# EAGLE schematic t10_schem (EAGLE 7.1.0)
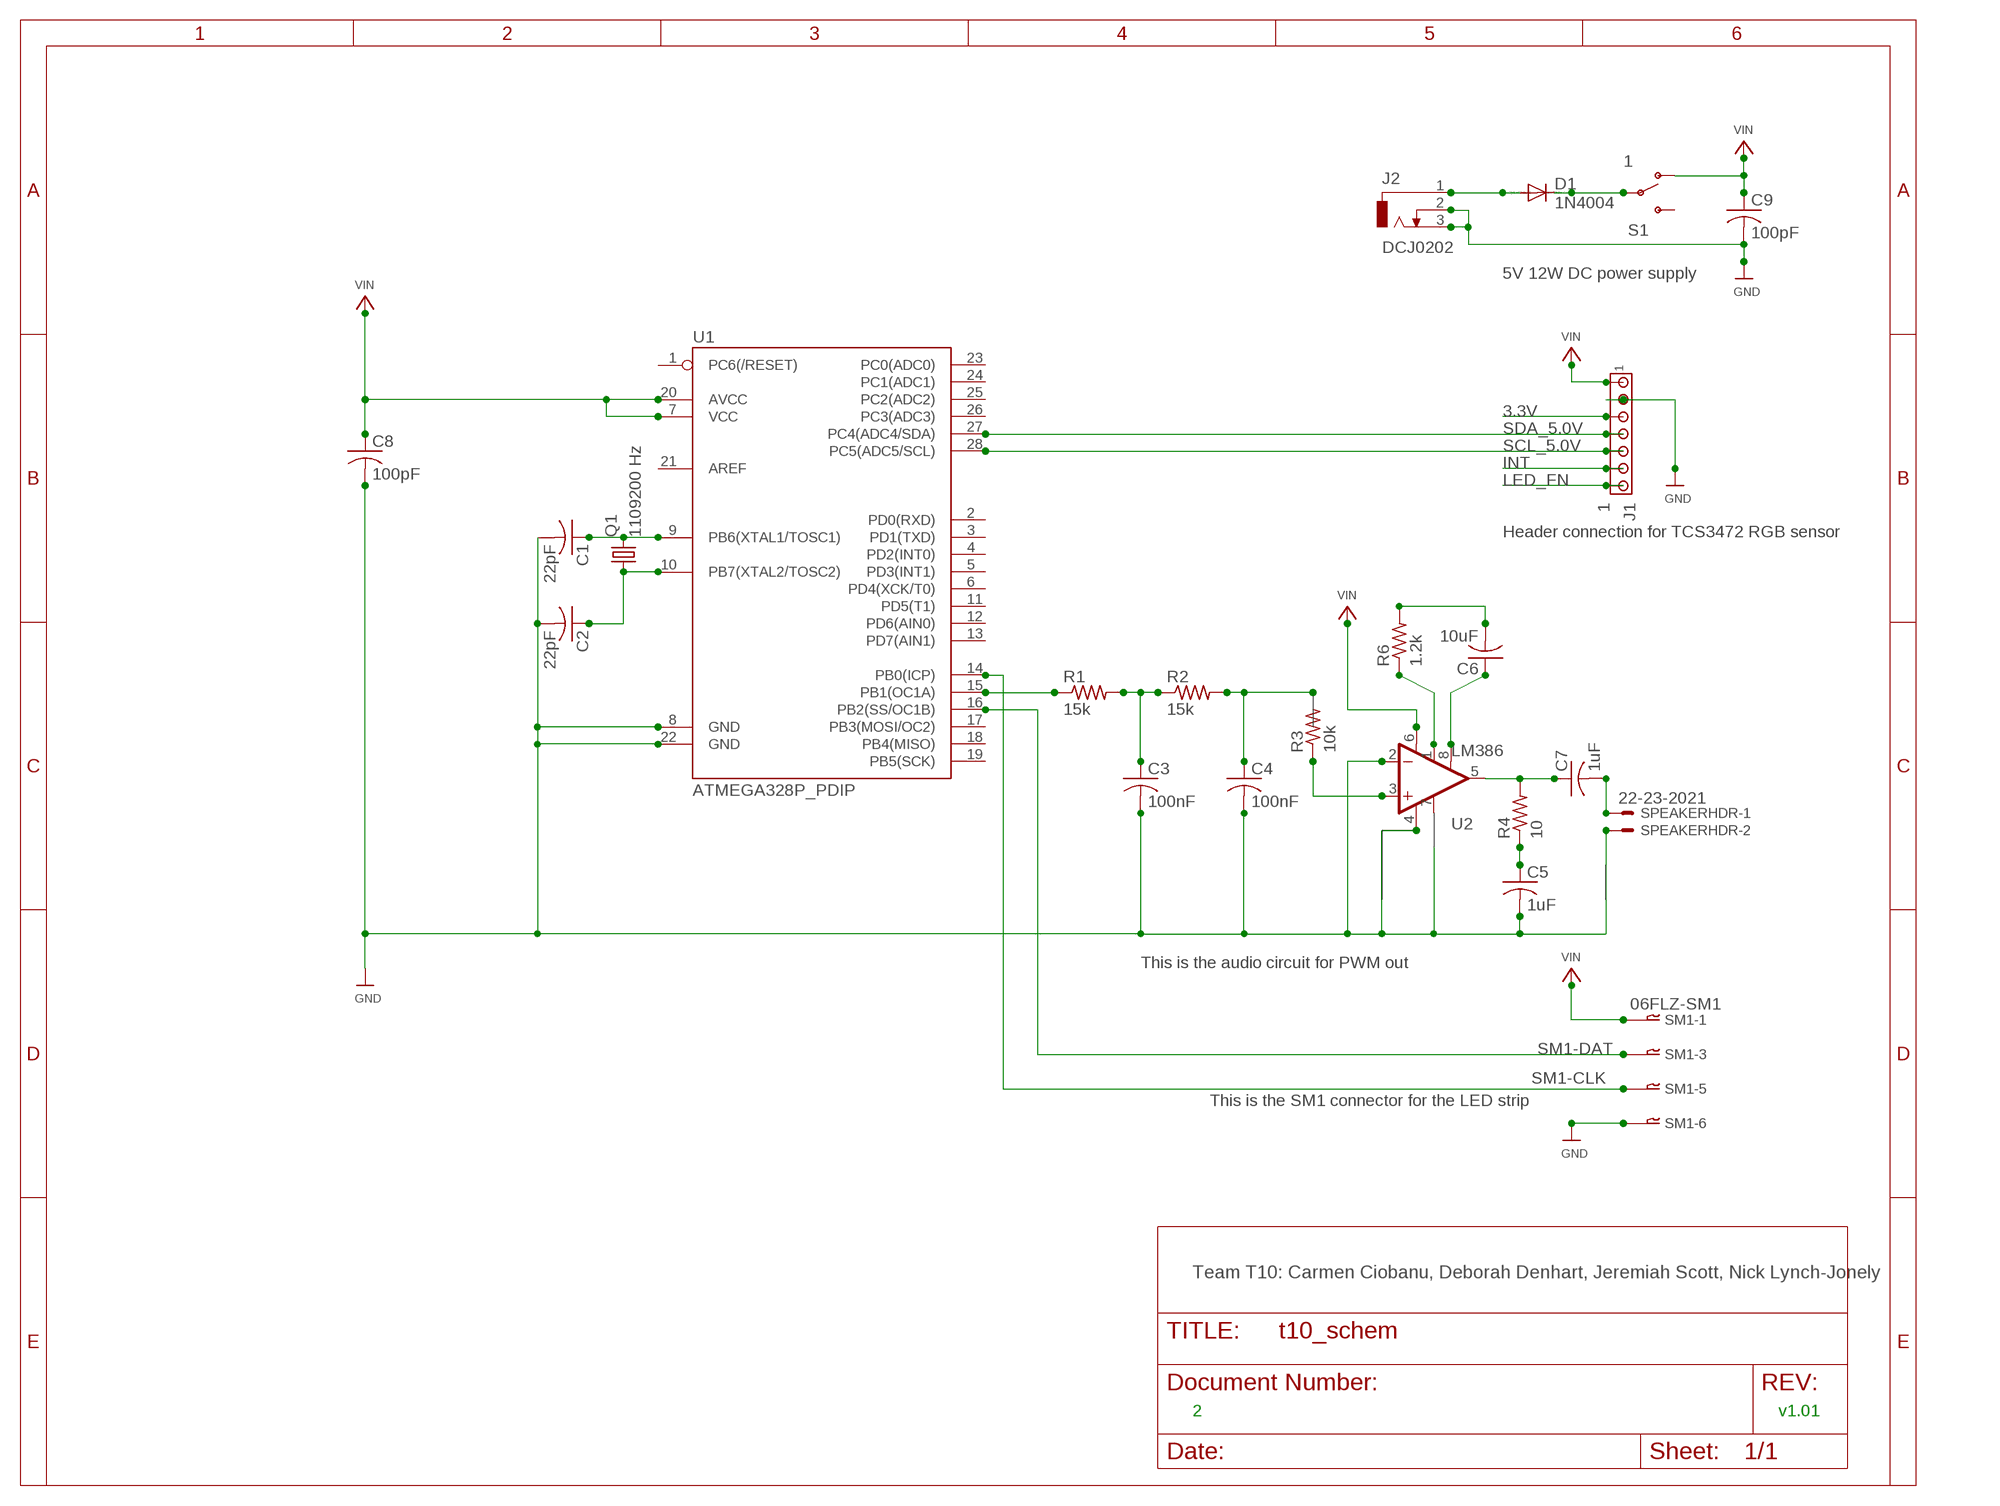
[diagram p0: schematic, sheet 1]

## Parts
C1  22pF  C-US025-024X044  [C025-024X044]
C2  22pF  C-US025-024X044  [C025-024X044]
C3  100nF  C-US025-024X044  [C025-024X044]
C4  100nF  C-US025-024X044  [C025-024X044]
C5  1uF  C-US025-024X044  [C025-024X044]
C6  10uF  C-US025-024X044  [C025-024X044]
C7  1uF  C-US025-024X044  [C025-024X044]
C8  100pF  C-US025-024X044  [C025-024X044]
C9  100pF  C-US025-024X044  [C025-024X044]
D1  1N4004  [DO41-10]
J1  1  MTA07-100  [10X07MTA]
J2  DCJ0202  [DCJ0202]
Q1  1109200 Hz  CRYSTALTC38H  [TC38H]
R1  15k  R-US_R0402  [R0402]
R2  15k  R-US_R0402  [R0402]
R3  10k  R-US_M0805  [M0805]
R4  10  R-US_M0805  [M0805]
R6  1.2k  R-US_M0805  [M0805]
S1  1  SWITCH-SPDT-SMD-A  [SWITCH-SPST-SMD-A]
SM1  06FLZ-SM1  [6FLZ-SM]
SPEAKERHDR  22-23-2021  [22-23-2021]
U1  ATMEGA328P_PDIP  [DIL28-3]
U2  LM386  [DIP08]

## Nets
3.3V: J1.3
GND: C1.2 C2.2 C3.2 C4.2 C5.2 C8.2 C9.2 J1.2 J2.2 J2.3 SM1.6 SPEAKERHDR.2 U1.8(GND) U1.22(GND) U2.2(-IN) U2.4(V-) U2.7(BP)
INT: J1.6
LED_FN: J1.7
N$1: C2.1 Q1.1 U1.10(PB7(XTAL2/TOSC2))
N$2: C1.1 Q1.2 U1.9(PB6(XTAL1/TOSC1))
N$3: R6.1 U2.1(GAIN)
N$4: R1.1 U1.15(PB1(OC1A))
N$5: C3.1 R1.2 R2.1
N$6: C4.1 R2.2 R3.2
N$7: C6.1 U2.8(GAIN)
N$8: R3.1 U2.3(+IN)
N$9: C5.1 R4.1
N$11: C6.2 R6.2
N$12: C7.1 R4.2 U2.5(OUT)
N$13: D1.A J2.1
N$14: C7.2 SPEAKERHDR.1
N$15: D1.C S1.2(P)
SCL_5.0V: J1.5 U1.28(PC5(ADC5/SCL))
SDA_5.0V: J1.4 U1.27(PC4(ADC4/SDA))
SM1-CLK: SM1.5 U1.14(PB0(ICP))
SM1-DAT: SM1.3 U1.16(PB2(SS/OC1B))
VIN: C8.1 C9.1 J1.1 S1.1(O) SM1.1 U1.7(VCC) U1.20(AVCC) U2.6(V+)
Unconnected: S1.3(S) SM1.2 SM1.4 U1.1(PC6(/RESET)) U1.2(PD0(RXD)) U1.3(PD1(TXD)) U1.4(PD2(INT0)) U1.5(PD3(INT1)) U1.6(PD4(XCK/T0)) U1.11(PD5(T1)) U1.12(PD6(AIN0)) U1.13(PD7(AIN1)) U1.17(PB3(MOSI/OC2)) U1.18(PB4(MISO)) U1.19(PB5(SCK)) U1.21(AREF) U1.23(PC0(ADC0)) U1.24(PC1(ADC1)) U1.25(PC2(ADC2)) U1.26(PC3(ADC3))

## Notes on the sheet
- 5V 12W DC power supply
- Header connection for TCS3472 RGB sensor
- This is the audio circuit for PWM out
- This is the SM1 connector for the LED strip
- Team T10: Carmen Ciobanu, Deborah Denhart, Jeremiah Scott, Nick Lynch-Jonely
- 2 | v1.01

## Library data of the parts
C1-C9 = resistor:C-US: CAPACITOR, American symbol
D1 = diode:1N4004: DIODE general purpose rectifier, 1 A
J1 = con-amp:MTA07-100: AMP connector
J2 = con-jack:DCJ0202: DC POWER JACK Source: DCJ0202.pdf; OC_FARNELL: unknown; OC_NEWARK: unknown
Q1 = crystal:CRYSTAL: CRYSTAL; OC_FARNELL: unknown; OC_NEWARK: unknown
R1-R4 R6 = resistor:R-US_: RESISTOR, American symbol
S1 = SparkFun-Electromechanical:SWITCH-SPDT: SPDT Switch Simple slide switch, Spark Fun Electronics SKU : COM-00102 DPDT SMT slide switch, AYZ0202, SWCH-08179
SM1 = con-jst:06FLZ-SM1: CONNECTOR; OC_FARNELL: unknown; OC_NEWARK: unknown
SPEAKERHDR = con-molex:22-23-2021: .100" (2.54mm) Center Header - 2 Pin; MF: MOLEX; MPN: 22-23-2021; OC_FARNELL: 1462926; OC_NEWARK: 25C3832
U1 = SparkFun-DigitalIC:ATMEGA328P_PDIP: uC used in the Arduino 32kb flash, 1k EEPROM, 2k SRAM This is the through-hole version of this chip.
U2 = SparkFun-AnalogIC:LM386: low voltage audio power amplifier